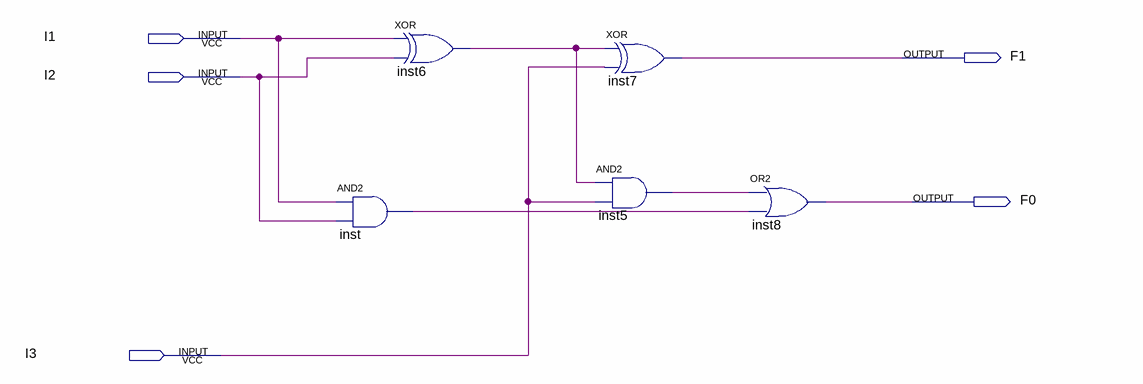
[diagram p0: schematic sheet]
// Quartus schematic ea01m01e03.bdf as structural Verilog: 5 symbols, 5 pins
module ea01m01e03 (
  input  I1,
  input  I2,
  input  I3,
  output F1,
  output F0
);

  wire inst5_out, inst6_out, inst_out;

  and inst (inst_out, I1, I2);
  xor inst6 (inst6_out, I1, I2);
  xor inst7 (F1, inst6_out, I3);
  and inst5 (inst5_out, inst6_out, I3);
  or inst8 (F0, inst5_out, inst_out);
endmodule
